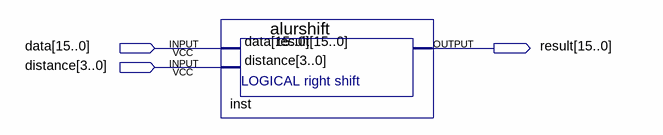
[diagram p0: schematic sheet]
// Quartus schematic lab4_3_2.bdf as structural Verilog: 1 symbols, 3 pins
module lab4_3_2 (
  input  [15:0] data,
  input  [3:0] distance,
  output [15:0] result
);

  alurshift inst (.data(data), .distance(distance), .result(result));
endmodule
